# EAGLE design AST1014 (EAGLE 6.3)
DATABASE: ./../../../../../Components/TinyCircuits_Part_Database.txt
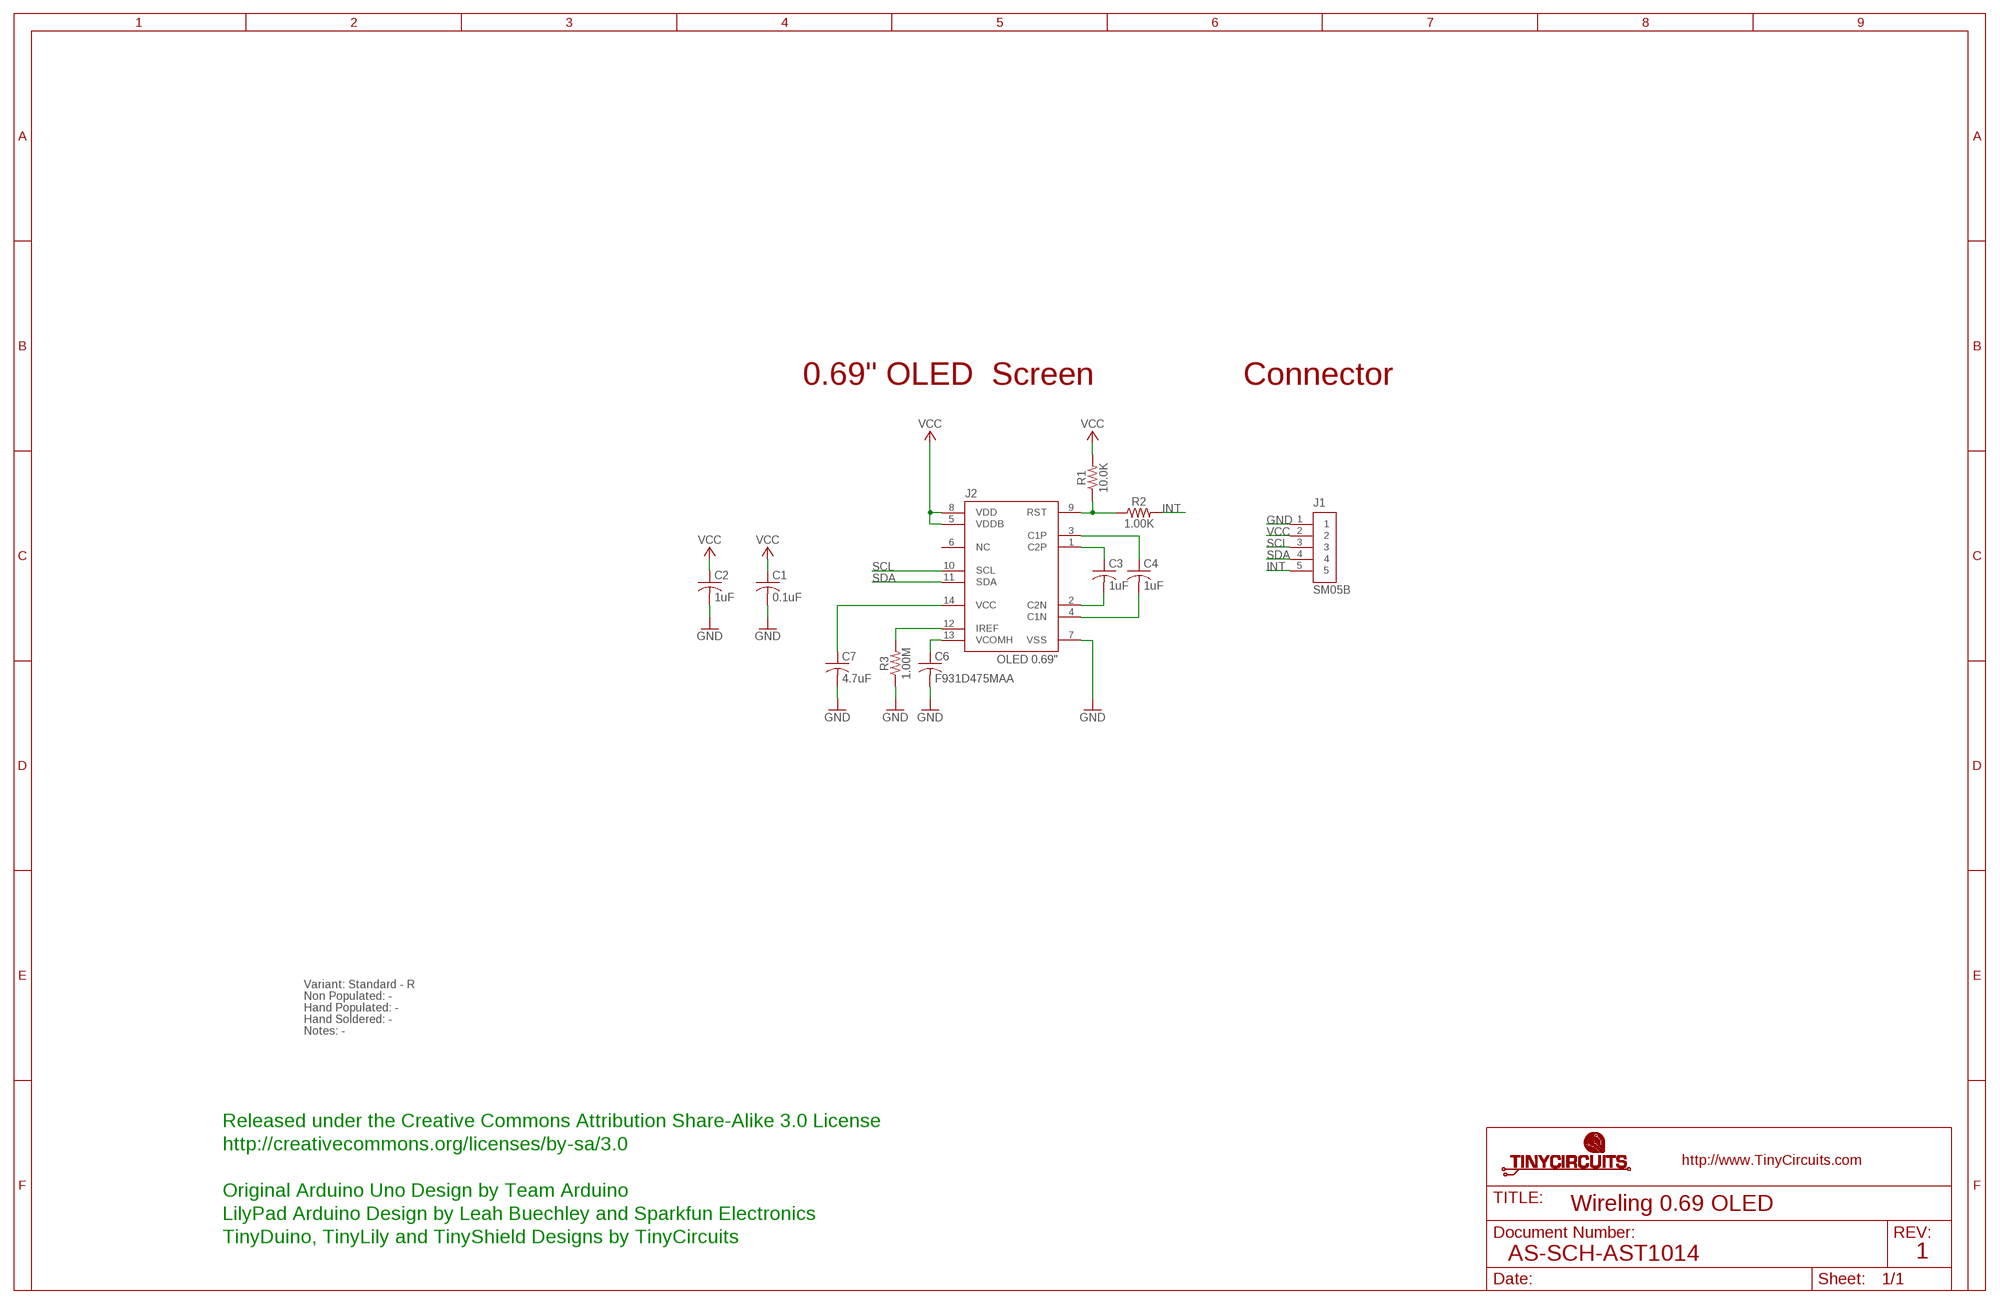
[diagram p0: schematic, sheet 1]

## Parts
C1  0.1uF  AS-ITM-00008  [C0402]
C2  1uF  AS-ITM-00347  [C0603]
C3  1uF  AS-ITM-00347  [C0603]
C4  1uF  AS-ITM-00347  [C0603]
C6  F931D475MAA  AS-ITM-00232  [1206_CAP_TANT]
C7  4.7uF  AS-ITM-00088  [C0603]
J1  SM05B  AS-ITM-00340  [JST_SH_5X1]
J2  OLED 0.69"  AS-ITM-00364  [OLED_WHITE_0.69"]
R1  10.0K  AS-ITM-00032  [0402]
R2  1.00K  AS-ITM-00003  [0402]
R3  1.00M  AS-ITM-00005  [0402]

## Nets
GND: C1.2 C2.2 C6.2 C7.2 J1.1 J2.7(VSS) R3.1
INT: J1.5 R2.2
N$1: C3.1 J2.1(C2P)
N$2: C6.1 J2.13(VCOMH)
N$4: C3.2 J2.2(C2N)
N$5: C4.2 J2.4(C1N)
N$6: C4.1 J2.3(C1P)
N$7: C7.1 J2.14(VCC)
N$8: J2.12(IREF) R3.2
N$10: J2.9(RST) R1.1 R2.1
SCL: J1.3 J2.10(SCL)
SDA: J1.4 J2.11(SDA)
VCC: C1.1 C2.1 J1.2 J2.5(VDDB) J2.8(VDD) R1.2
Unconnected: J2.6(NC)

## Notes on the sheet
- 0.69" OLED  Screen | Connector
- Variant: Standard - R
- Non Populated: -
- Hand Populated: -
- Hand Soldered: -
- Notes: -
- Released under the Creative Commons Attribution Share-Alike 3.0 License
- http://creativecommons.org/licenses/by-sa/3.0
- Original Arduino Uno Design by Team Arduino
- Wireling 0.69 OLED
- LilyPad Arduino Design by Leah Buechley and Sparkfun Electronics
- TinyDuino, TinyLily and TinyShield Designs by TinyCircuits
- AS-SCH-AST1014 | 1

## Library data of the parts
C1 = tinycircuits:AS-ITM-00008: CAP CER 0.1UF 16V 10% X5R 0402; PARTNO: AS-ITM-00008
C2-C4 = tinycircuits:AS-ITM-00347: CAP CER 1UF 16V X7R 0603; PARTNO: AS-ITM-00347
C6 = tinycircuits:AS-ITM-00232: CAP TANT 4.7UF 20V 20% 1206; PARTNO: AS-ITM-00232; PNPROTATION: 180
C7 = tinycircuits:AS-ITM-00088: CAP CER 4.7UF 6.3V 20% X5R 0603; PARTNO: AS-ITM-00088
J1 = tinycircuits:AS-ITM-00340: CONN HEADER SH 5POS SIDE 1MM TIN; PARTNO: AS-ITM-00340; PNPROTATION: 180
J2 = tinycircuits:AS-ITM-00364: OLED SCREEN WHITE 0.69" 96x16; PARTNO: AS-ITM-00364
R1 = tinycircuits:AS-ITM-00032: RES 10.0K OHM 1/16W 1% 0402 SMD; PARTNO: AS-ITM-00032
R2 = tinycircuits:AS-ITM-00003: RES 1.00K OHM 1/16W 1% 0402; PARTNO: AS-ITM-00003
R3 = tinycircuits:AS-ITM-00005: RES 1.00M OHM 1/16W 1% 0402; PARTNO: AS-ITM-00005

## Net classes
2 gnd: width 0.305 mm, drill 0.559 mm, clearance 0.254 mm

## Board
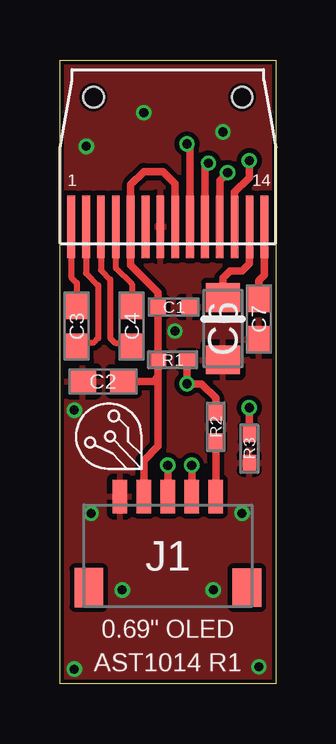
[diagram p1: board, top side]
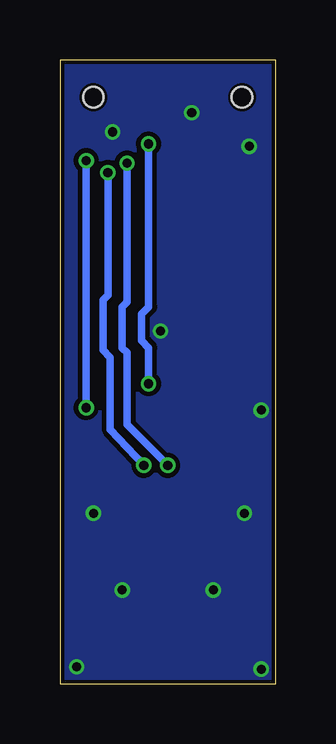
[diagram p2: board, bottom side, seen from below]

Size 9 x 26 mm. Coordinates in mm from the lower left corner, seen from the top.
Outline: 0,0 0,26 9,26 9,0 0,0
Copper layers (1*16): Top 0.035mm / dielectric 1.5mm / Bottom 0.035mm
Design rules "default *": minimum track width 8mil, minimum drill 15mil, track to track 8mil, track to pad 8mil, pad to pad 8mil, via to via 8mil, smd to smd 8mil, copper to edge 6mil, drill to drill 8mil, minimum pad ring 8mil, minimum via ring 5mil, stop-mask expansion 4mil, vias tented up to drill 25mil, thermal gap 10mil

### Footprints (pad centres in the part's own frame; a part is rotated, then mirrored left to right if it is on the bottom)
C0402 = smd 0.65 x 0.6: 1 -0.65,0; 2 0.65,0
C0603 = smd 1.1 x 1: 1 -0.85,0; 2 0.85,0
1206_CAP_TANT = smd 1.2 x 1.4: 1 -1.3,0; 2 1.3,0
JST_SH_5X1 = smd 0.6 x 1.4: 1 -2,2.475; 2 -1,2.475; 3 0,2.475; 4 1,2.475; 5 2,2.475 | smd 1.2 x 1.6: PAD1 -3.3,-1.325; PAD2 3.3,-1.325
OLED_WHITE_0.69" = smd 0.32 x 2.6: 1 -4.03,-3.55; 2 -3.41,-3.55; 3 -2.79,-3.55; 4 -2.17,-3.55; 5 -1.55,-3.55; 6 -0.93,-3.55; 7 -0.31,-3.55; 8 0.31,-3.55; 9 0.93,-3.55; 10 1.55,-3.55; 11 2.17,-3.55; 12 2.79,-3.55; 13 3.41,-3.55; 14 4.03,-3.55 | hole 0.85: -3.1,1.85; 3.1,1.85
0402 = smd 0.65 x 0.55: 1 -0.6,0; 2 0.6,0

### Placement (x,y rotation side)
C1  4.75,15.7 0 top
C2  1.8,12.6 180 top
C3  0.7,14.9 270 top
C4  3,14.9 90 top
C6  6.8,14.8 270 top
C7  8.3,15.2 270 top
J1  4.5,5.32 0 top
J2  4.5,22.6 0 top
R1  4.7,13.5 180 top
R2  6.5,10.7 270 top
R3  7.9,9.8 90 top
U$1  [DOCFIELD-TINYCIRCUITS-PCB]  24,-5 0 top  (outside the outline)

### Tracks (layer width: path | path; a pad name or v marks a point on that pad's centre or on a via)
GND  (via drill 0.38)
  other vias: 6.4,3.9 2.6,3.9 1.3,7.1 4.8,14.7 6.8,23 1.1,22.4 8.3,0.7 0.6,0.6 7.6,7.1 0.6,11.4 3.5,23.8
  pour Top: 9,0 9,26 0,26 0,0
  pour Bottom: 9,0 9,26 0,26 0,0
INT
  Top 0.305: J1.5 R2.2
N$1
  Top 0.254: J2.1 0.47,16.93 0.7,16.7 C3.1
N$2
  Top 0.305: J2.13 7.91,17.51 7.6,17.2 7.1,17.2 6.8,16.9 C6.1
N$4
  Top 0.254: J2.2 1.09,17.11 1.6,16.6 1.6,14.4 1.4,14.2 0.75,14.2 C3.2
N$5
  Top 0.254: J2.4 2.33,17.32 3,16.65 C4.2
N$6
  Top 0.254: J2.3 1.71,17.24 2.1,16.85 2.1,14.4 2.3,14.2 2.85,14.2 C4.1
N$7
  Top 0.305: J2.14 8.53,17.03 8.3,16.8 C7.1
N$8  (via drill 0.38)
  Top 0.305: R3.2 v7.9,11.5 | J2.12 7.29,20.49 7.9,21.1 v7.9,21.8
  Bottom 0.305: v7.9,21.8 v7.9,11.5
N$10  (via drill 0.38)
  Top 0.305: R2.1 6.5,11.9 5.9,12.5 v5.3,12.5 R1.1 | J2.9 5.43,22.37 v5.3,22.5
  Bottom 0.305: v5.3,12.5 5.3,14 5.6,14.3 5.6,15.4 5.3,15.7 v5.3,22.5
SCL  (via drill 0.38)
  Top 0.305: J2.10 6.05,21.55 v6.2,21.7 | J1.3 v4.5,9.1
  Bottom 0.305: v6.2,21.7 6.2,15.9 6.4,15.7 6.4,14 6.2,13.8 6.2,10.8 v4.5,9.1
SDA  (via drill 0.38)
  Top 0.305: J2.11 6.67,20.97 v7,21.3 | J1.4 v5.5,9.1
  Bottom 0.305: v7,21.3 7,16.2 7.2,16 7.2,13.9 6.9,13.6 6.9,10.6 v5.5,9.1
VCC
  Top 0.305: J2.8 4.8,19.26 4.8,20.85 4.3,21.35 3.5,21.35 2.95,20.8 J2.5 2.95,17.45 4.1,16.3 C1.1 R1.2 | J1.2 3.5,9.3 4.1,9.9 R1.2 | C2.1 3.9,12.6 4.1,12.8 R1.2

### Text on the board
tPlace: 0.69" OLED | AST1014 R1
Document: FABRICATION DRAWING | NOTES: | 1. PRINTED CIRCUIT BOARD MADE FROM NEMA GRADE FR-4 EPOXY LAMINATE | WITH 1 OUNCE COPPER PLATING AND .024 THICKNESS. | 2. ALL DIMENSIONS ARE GIVEN IN MILLIMETERS. | 3. CIRCUIT PATHS ARE FOR REFERENCE ONLY. | 4. HOLE SIZES SHOWN ARE FINISHED DIAMETERS AFTER PLATING. | 5. BOARD PLATED USING REFLOW OR SIMILAR METHOD. | 6. BOARD TO HAVE BLUE SOLDER MASK ON PLATED SURFACES USING WET FILM | 7. SILKSCREEN BOARD USING WHITE INK. | SR100 OR SR1010 EPOXY. EQUIVALENT WET OR DRY FILM MAY BE USED. | 8. THE FOLLOWING INFORMATION APPLIES TO THIS BOARD: | * 2 COPPER LAYERS | * .024 BOARD THICKNESS | * REQUIRES TOP SIDE SILKSCREEN | Released under the Creative Commons Attribution Share-Alike 3.0 License | http://creativecommons.org/licenses/by-sa/3.0 | Original Arduino Uno Design by Team Arduino | LilyPad Arduino Design by Leah Buechley and Sparkfun Electronics | TinyDuino, TinyLily and TinyShield Designs by TinyCircuits | Wireling 0.69 OLED | AS-PCB-AST1014 | 1